# Altium schematic sheet LinkS.SchDoc
size 457 x 304 mm
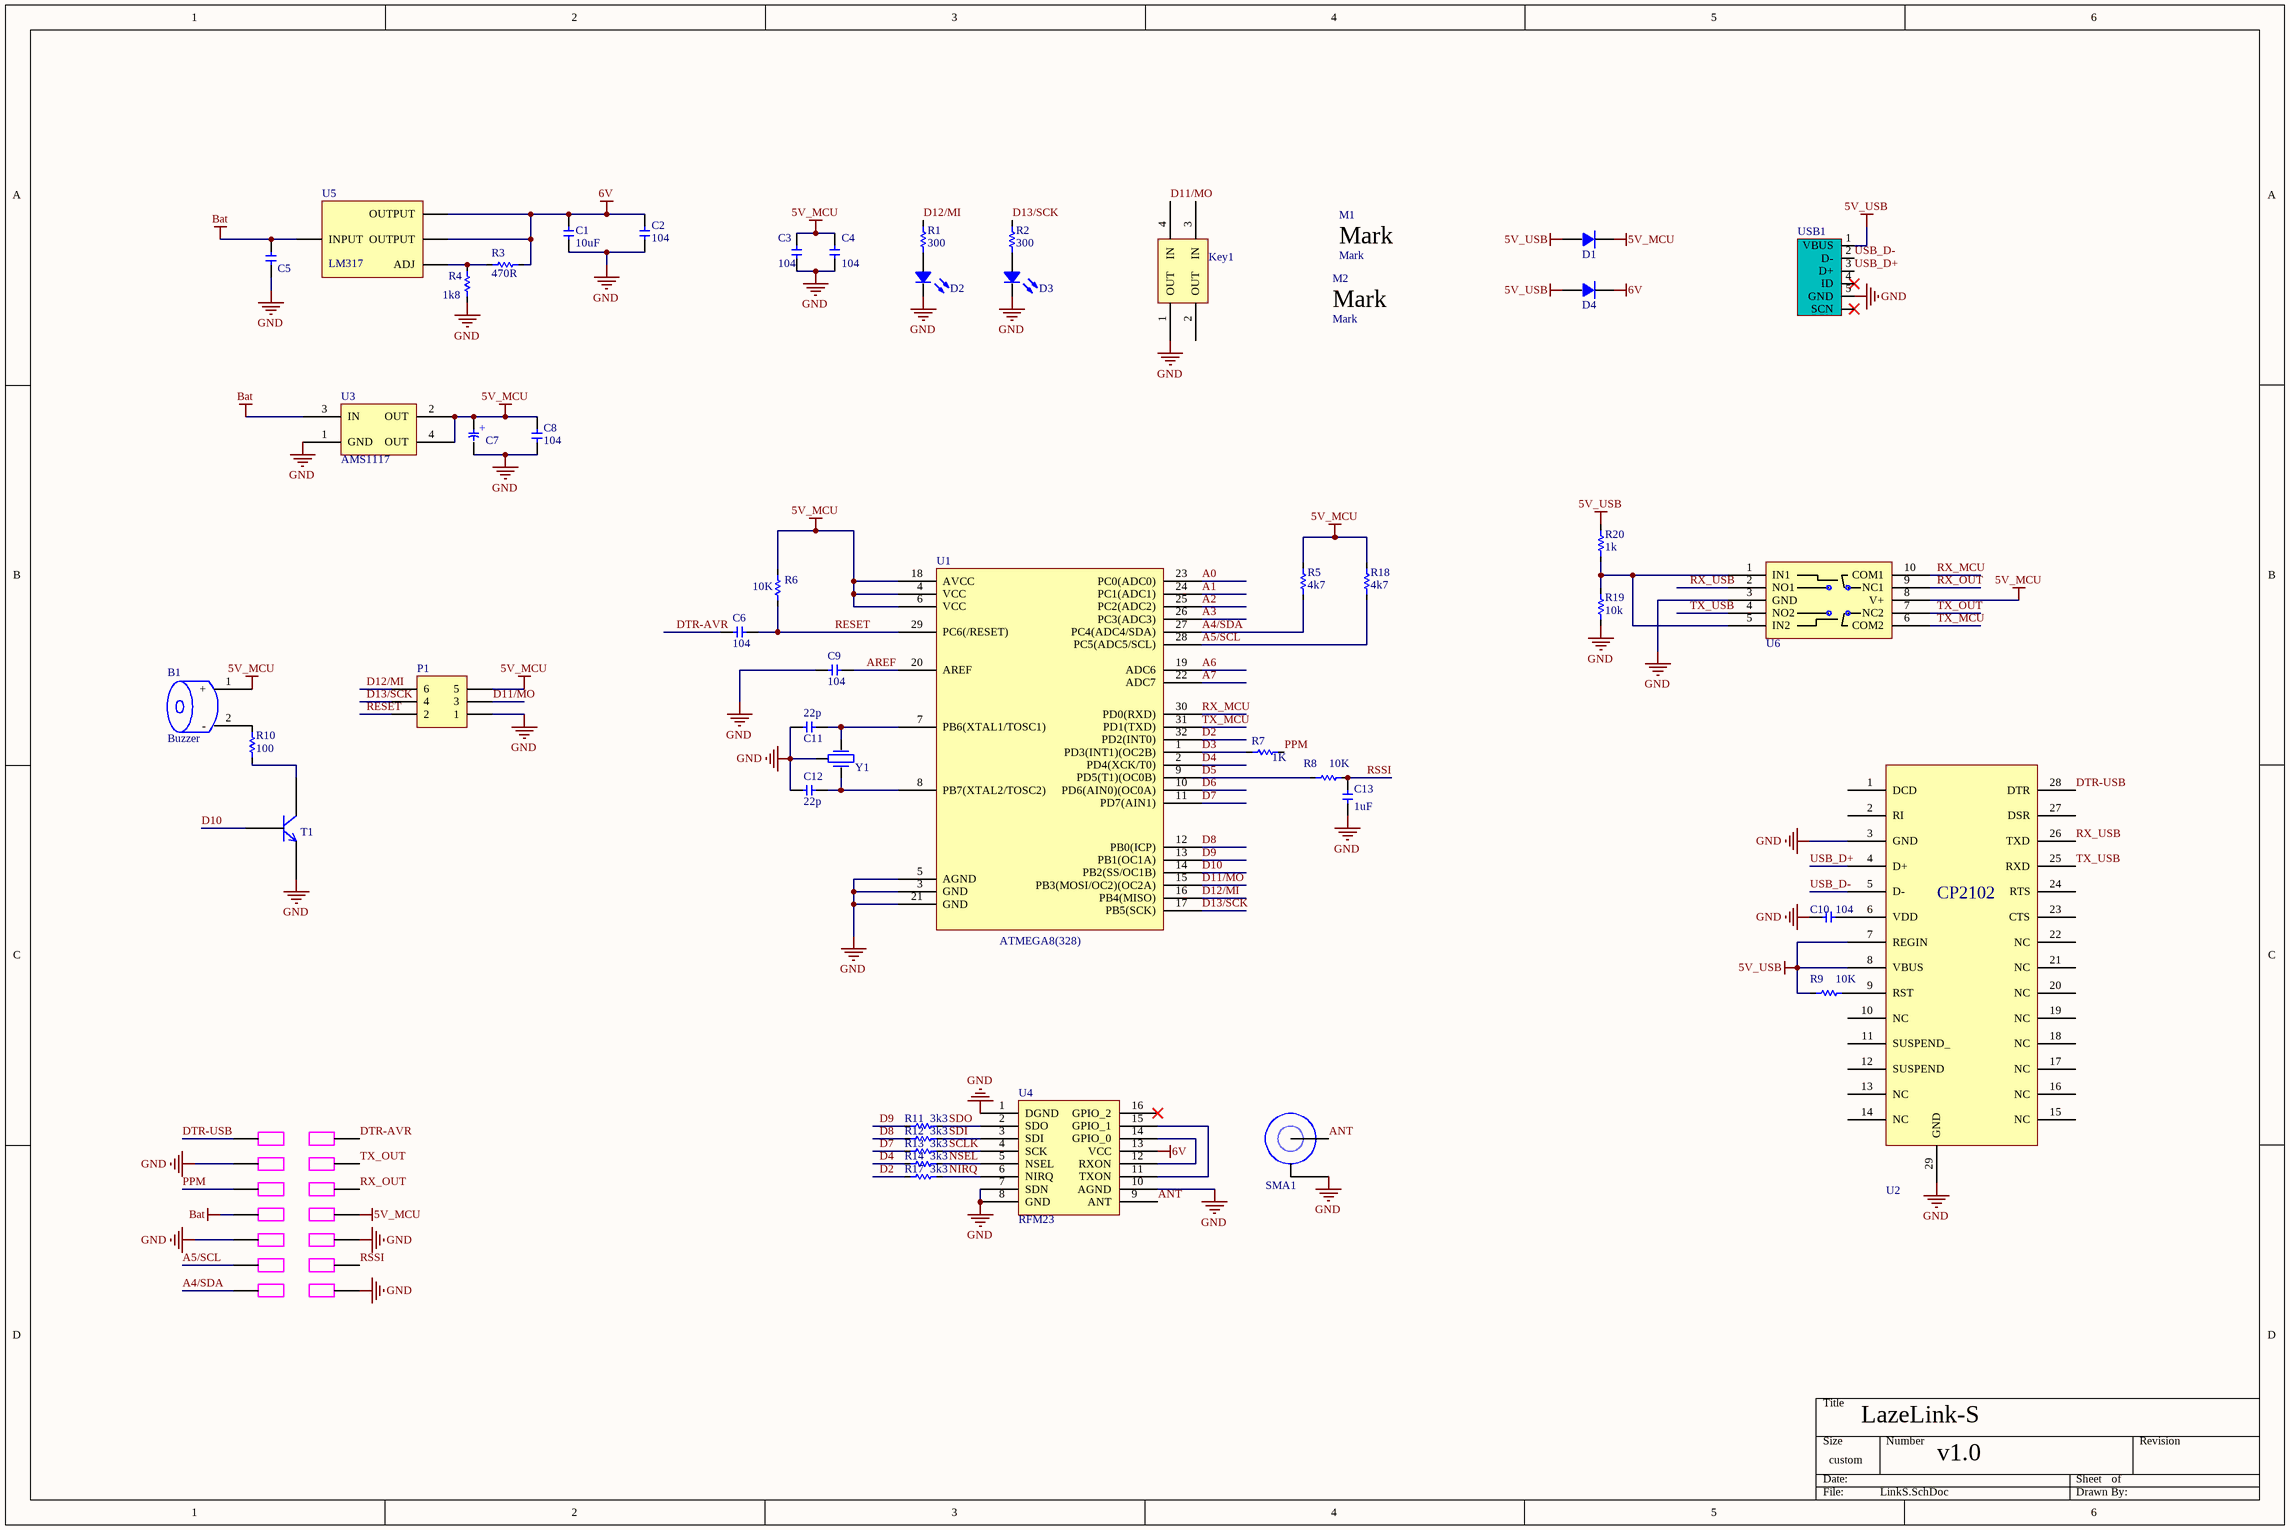
[diagram p0: LinkS.SchDoc]

## Parts
B1  Buzzer  [BUZZER9055]
C1  10uF  [1206 CAP]
C2  104  [0603 CAP]
C3  104  [0603 CAP]
C4  104  [0603 CAP]
C5  10uF  [1206]  (value not drawn)
C6  104  [0603 CAP]
C7  10uf  [1206 CAP]  (value not drawn)
C8  104  [0603 CAP]
C9  104  [0603 CAP]
C10  104  [0603 CAP]
C11  22p  [0603 CAP]
C12  22p  [0603 CAP]
C13  1uF  [0603 CAP]
D1  Diode  [DIODE-SOD123]  (value not drawn)
D2  LED  [0805 LED]  (value not drawn)
D3  LED  [0805 LED]  (value not drawn)
D4  Diode  [DIODE-SOD123]  (value not drawn)
Key1  KeySMT  [KEY SMT BIGGER]  (value not drawn)
M1  Mark  [MarkPoint]
M2  Mark  [MarkPoint]
P1  Header 3X2  [HDR2X3]  (value not drawn)
Pad1  EdgePad  [edgepad]  (value not drawn)
Pad2  EdgePad  [edgepad]  (value not drawn)
Pad3  EdgePad  [edgepad]  (value not drawn)
Pad4  EdgePad  [edgepad]  (value not drawn)
Pad5  EdgePad  [edgepad]  (value not drawn)
Pad6  EdgePad  [edgepad]  (value not drawn)
Pad7  EdgePad  [edgepad]  (value not drawn)
Pad8  EdgePad  [edgepad]  (value not drawn)
Pad9  EdgePad  [edgepad]  (value not drawn)
Pad10  EdgePad  [edgepad]  (value not drawn)
Pad11  EdgePad  [edgepad]  (value not drawn)
Pad12  EdgePad  [edgepad]  (value not drawn)
Pad13  EdgePad  [edgepad]  (value not drawn)
Pad14  EdgePad  [edgepad]  (value not drawn)
R1  300  [0603 RES]
R2  300  [0603 RES]
R3  470R  [0603 RES]
R4  1k8  [0603 RES]
R5  4k7  [0603 RES]
R6  10K  [0603 RES]
R7  1K  [0603 RES]
R8  10K  [0603 RES]
R9  10K  [0603 RES]
R10  100  [0603 RES]
R11  3k3  [0603 RES]
R12  3k3  [0603 RES]
R13  3k3  [0603 RES]
R14  3k3  [0603 RES]
R17  3k3  [0603 RES]
R18  4k7  [0603 RES]
R19  10k  [0603 RES]
R20  1k  [0603 RES]
SMA1  SMA Base  [ANT SMA]  (value not drawn)
T1  NPN  [NPN-SOT-23B_M]  (value not drawn)
U1  ATmega328  [ATMEGA328FIX]  (value not drawn)
U2  CP2102  [CP2102]  (value not drawn)
U3  AMS1117  [ams1117]
U4  RFM23  [RFM23MODULE]
U5  LM317  [SOT230P700X180-4N]
U6  TS5A23157  [TS5A23157]  (value not drawn)
USB1  USB  [MINI USB A]  (value not drawn)
Y1  Crystal3Foot  [Crystal3Foot]  (value not drawn)

## Nets
5V_MCU: B1.1(+) C3.1 C4.1 C7.1(A) C8.1 D1.2(B) P1.5 Pad8.1 R5.2 R6.2 R18.2 U1.4(VCC) U1.6(VCC) U1.18(AVCC) U3.2(OUT) U3.4(OUT) U6.8(V+)
5V_USB: D1.1(A) D4.1(A) R9.2 R20.2 U2.7(REGIN) U2.8(VBUS) USB1.1(VBUS)
6V: C1.1 C2.1 D4.2(B) R3.1 U4.13(VCC) U5.2(OUTPUT) U5.4(OUTPUT)
Bat: C5.2 Pad7.1 U3.3(IN) U5.3(INPUT)
GND: C1.2 C2.2 C3.2 C4.2 C5.1 C7.2(B) C8.2 C9.2 C10.1 C11.1 C12.1 C13.1 D2.2(K) D3.2(K) Key1.1(OUT) P1.1 Pad3.1 Pad9.1 Pad10.1 Pad14.1 R4.2 R19.1 SMA1.2(Gnd) T1.2(Gnd) U1.3(GND) U1.5(AGND) U1.21(GND) U2.3(GND) U2.29(GND) U3.1(GND) U4.1(DGND) U4.7(SDN) U4.8(GND) U4.10(AGND) U6.3(GND) USB1.5(GND) Y1.2
A0: U1.23(PC0(ADC0))
A1: U1.24(PC1(ADC1))
A2: U1.25(PC2(ADC2))
A3: U1.26(PC3(ADC3))
A4/SDA: Pad13.1 R5.1 U1.27(PC4(ADC4/SDA))
A5/SCL: Pad11.1 R18.1 U1.28(PC5(ADC5/SCL))
A6: U1.19(ADC6)
A7: U1.22(ADC7)
ANT: SMA1.1(Ant) U4.9(ANT)
AREF: C9.1 U1.20(AREF)
D2: R17.2 U1.32(PD2(INT0))
D3: R7.2 U1.1(PD3(INT1)(OC2B))
D4: R14.2 U1.2(PD4(XCK/T0))
D5: R8.2 U1.9(PD5(T1)(OC0B))
D6: U1.10(PD6(AIN0)(OC0A))
D7: R13.2 U1.11(PD7(AIN1))
D8: R12.2 U1.12(PB0(ICP))
D9: R11.2 U1.13(PB1(OC1A))
D10: T1.1(Sig) U1.14(PB2(SS/OC1B))
D11/MO: Key1.4(IN) P1.3 U1.15(PB3(MOSI/OC2)(OC2A))
D12/MI: P1.6 R1.1 U1.16(PB4(MISO))
D13/SCK: P1.4 R2.1 U1.17(PB5(SCK))
DTR-AVR: C6.2 Pad2.1
DTR-USB: Pad1.1 U2.28(DTR)
NIRQ: R17.1 U4.6(NIRQ)
NSEL: R14.1 U4.5(NSEL)
PPM: Pad5.1 R7.1
RESET: C6.1 P1.2 R6.1 U1.29(PC6(/RESET))
RSSI: C13.2 Pad12.1 R8.1
RX_MCU: U1.30(PD0(RXD)) U6.10(COM1)
RX_OUT: Pad6.1 U6.9(NC1)
RX_USB: U2.26(TXD) U6.2(NO1)
SCLK: R13.1 U4.4(SCK)
SDI: R12.1 U4.3(SDI)
SDO: R11.1 U4.2(SDO)
TX_MCU: U1.31(PD1(TXD)) U6.6(COM2)
TX_OUT: Pad4.1 U6.7(NC2)
TX_USB: U2.25(RXD) U6.4(NO2)
USB_D+: U2.4(D+) USB1.3(D+)
USB_D-: U2.5(D-) USB1.2(D-)
NetB1_2: B1.2(-) R10.1
NetC10_2: C10.2 U2.6(VDD)
NetC11_2: C11.2 U1.7(PB6(XTAL1/TOSC1)) Y1.1
NetC12_2: C12.2 U1.8(PB7(XTAL2/TOSC2)) Y1.3
NetD2_1: D2.1(A) R1.2
NetD3_1: D3.1(A) R2.2
NetR3_2: R3.2 R4.1 U5.1(ADJ)
NetR9_1: R9.1 U2.9(RST)
NetR10_2: R10.2 T1.3(Collector)
NetR19_2: R19.2 R20.1 U6.1(IN1) U6.5(IN2)
NetU4_11: U4.11(TXON) U4.15(GPIO_1)
NetU4_12: U4.12(RXON) U4.14(GPIO_0)

Not connected (* = marked no-connect by the designer): Key1 2(OUT) 3(IN); U2 1(DCD) 2(RI) 10(NC) 11(SUSPEND_) 12(SUSPEND) 13(NC) 14(NC) 15(NC) 16(NC) 17(NC) 18(NC) 19(NC) 20(NC) 21(NC) 22(NC) 23(CTS) 24(RTS) 27(DSR); U4 16(GPIO_2)*; USB1 0(SCN)* 4(ID)*

## Notes on the sheet
- LazeLink-S
- v1.0
- (in symbol ATmega328) ATMEGA8(328)
- (in symbol Cap Pol) +

## Library data of the parts
C1-C6 C8-C13 = CAP: Capacitor; Value: 100nF; Published: 8-Jun-2000; Revision: July-2002: Re-released for DXP Platform.; Publisher: Altium Limited
C7 = Cap Pol: Capacitor
D2 D3 = LED: Typical RED, GREEN, YELLOW, AMBER GaAs LED; Published: 8-Jun-2000; LatestRevisionDate: 17-Jul-2002; LatestRevisionNote: Re-released for DXP Platform.; PackageDocument: Feb-2002; PackageReference: 3.2X1.6X1.1; Publisher: Altium Limited
P1 = Header 3X2: Header, 3-Pin, Dual row; LatestRevisionDate: 17-Jul-2002; LatestRevisionNote: Re-released for DXP Platform.; Publisher: Altium Limited
R1-R14 R17-R20 = Res: Resistor; Published: 8-Jun-2000; Revision: July-2002: Re-released for DXP Platform.; Publisher: Altium Limited
U3 = AMS1117: 1117
USB1 = USB_SMT_B: USB Type-B SMT Socket; Class: Connector; Supplier 1: Digi-Key; Supplier Part Number 1: 670-1190-1-ND